# Altium schematic sheet SCREEN.SchDoc
size A3; SheetNumber: 10; SheetTotal: 17
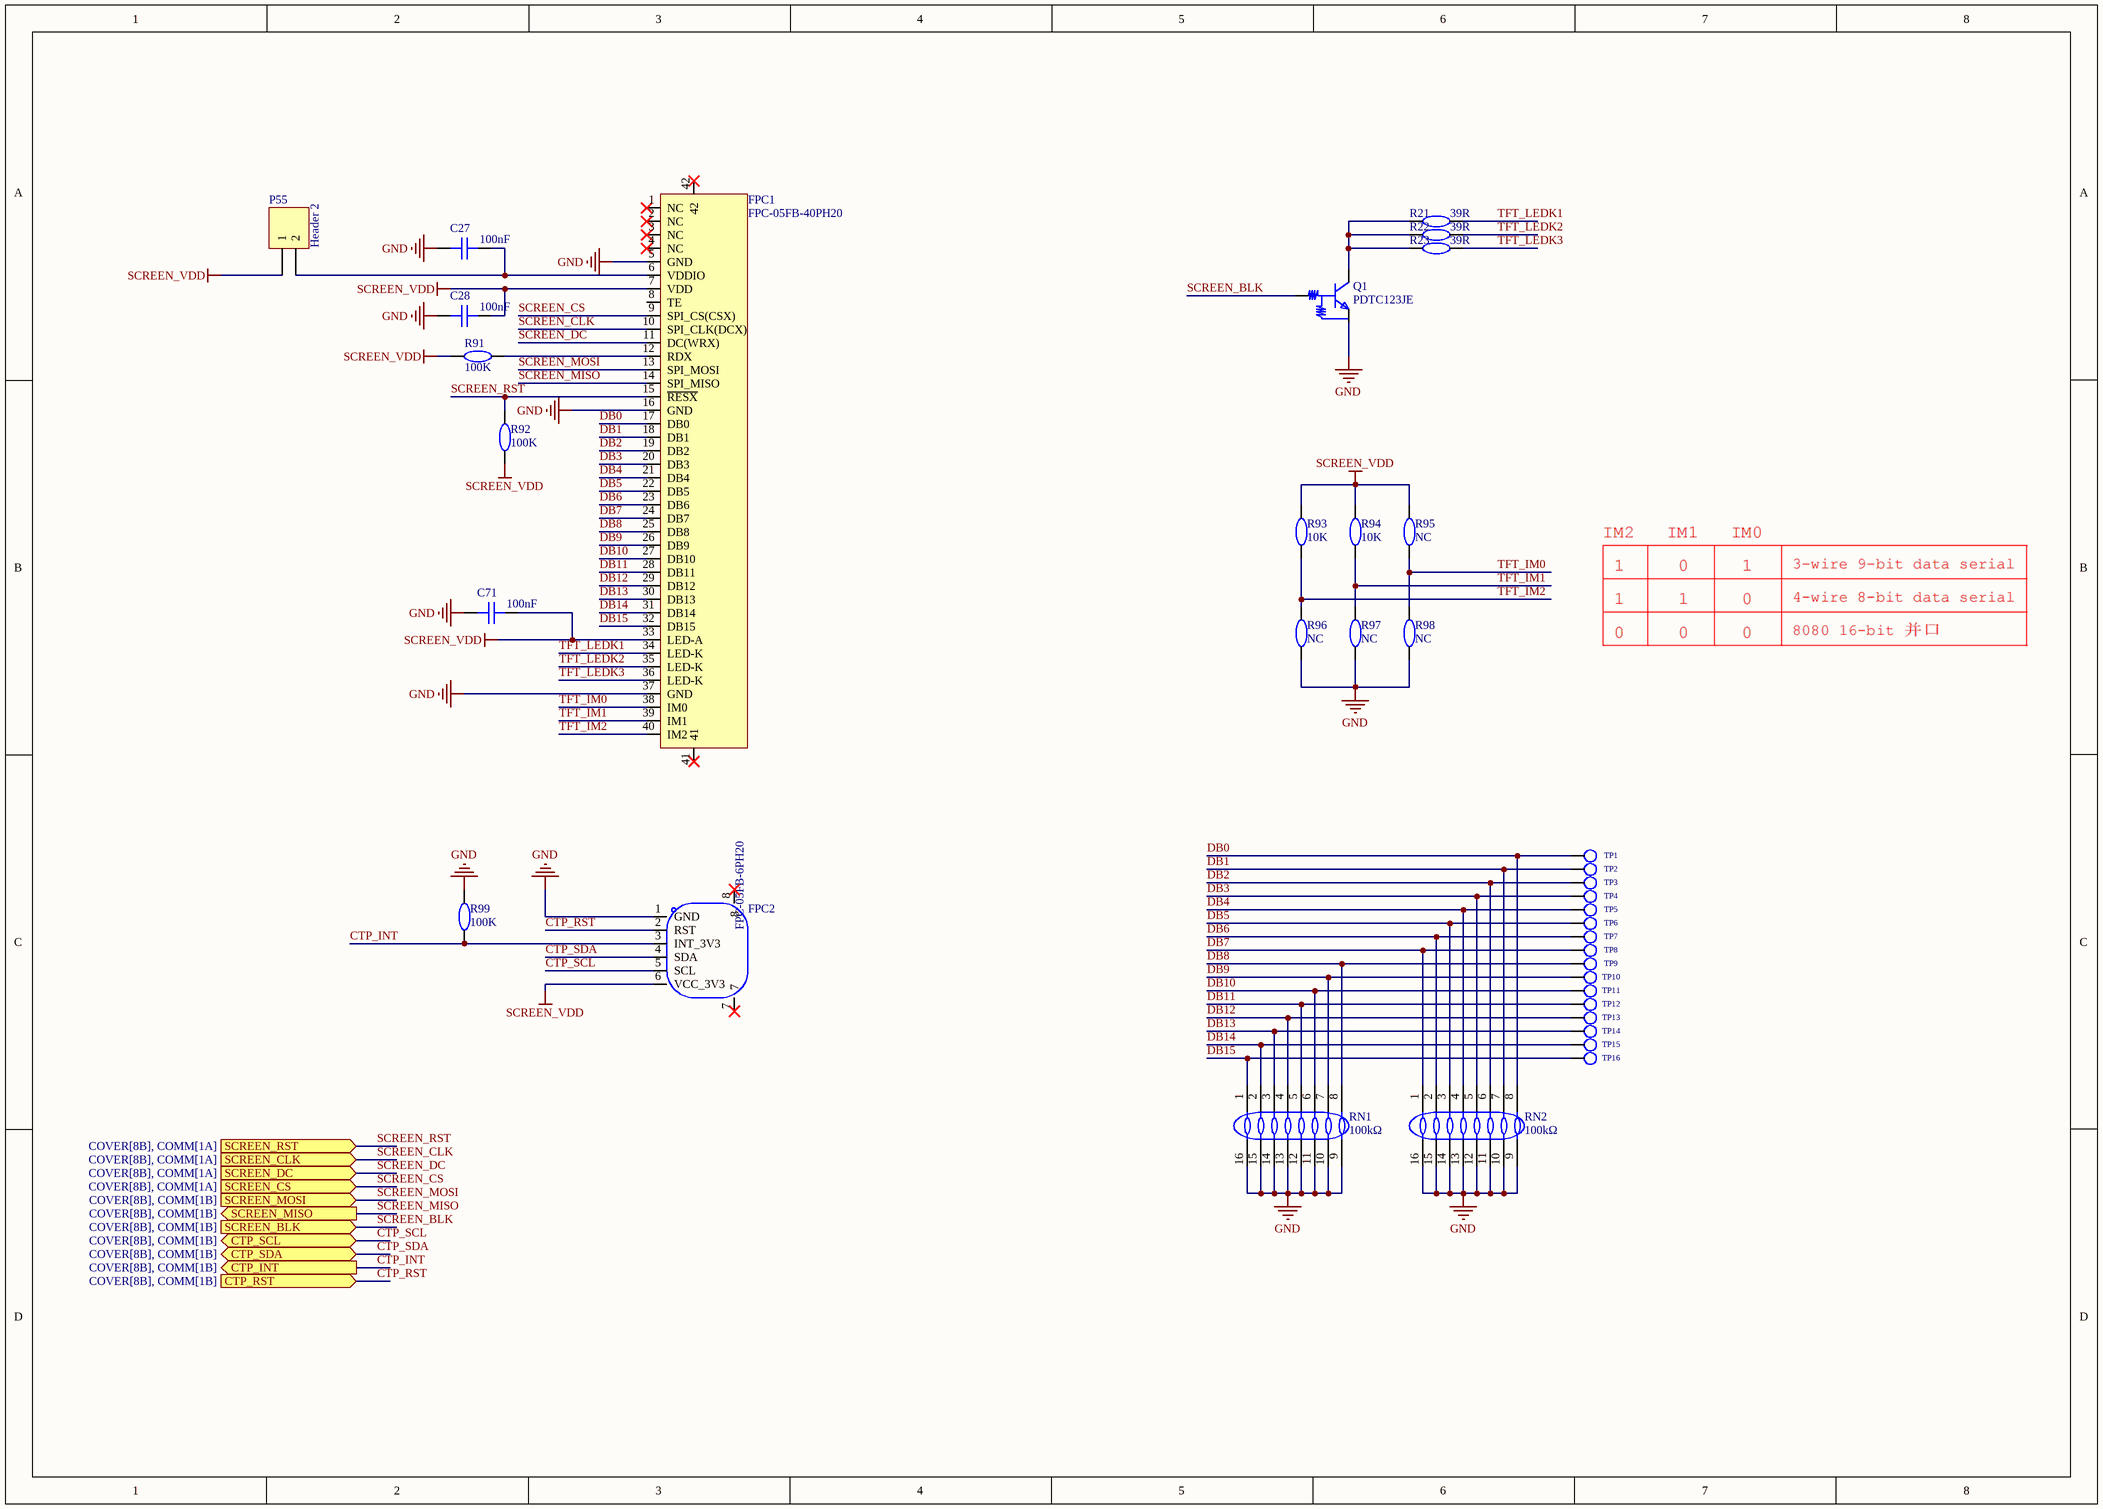
[diagram p0: SCREEN.SchDoc]

## Parts
C27  100nF  [C0402]
C28  100nF  [C0402]
C71  100nF  [C0402]
FPC1  FPC-05FB-40PH20  [FPC-SMD_40P-P0.50_XUNPU_FPC-05FB-40PH20]
FPC2  FPC-05FB-6PH20  [FPC-SMD_6P-P0.50_FPC-05FB-6PH20]
P55  Header 2  [HDR1X2]
Q1  PDTC123JE  [SOT-523_L1.6-W0.8-P1.00-LS1.6-BR]
R21  39R  [R0402]
R22  39R  [R0402]
R23  39R  [R0402]
R91  100K  [R0402]
R92  100K  [R0402]
R93  10K  [R0603]
R94  10K  [R0603]
R95  NC  [R0603]
R96  NC  [R0603]
R97  NC  [R0603]
R98  NC  [R0603]
R99  100K  [R0402]
RN1  100kΩ  [RES-ARRAY-SMD_16P-L3.8-W1.6-P0.50-BL]
RN2  100kΩ  [RES-ARRAY-SMD_16P-L3.8-W1.6-P0.50-BL]
TP1  T-SMD  [PAD_1.0_SMT]  (value not drawn)
TP2  T-SMD  [PAD_1.0_SMT]  (value not drawn)
TP3  T-SMD  [PAD_1.0_SMT]  (value not drawn)
TP4  T-SMD  [PAD_1.0_SMT]  (value not drawn)
TP5  T-SMD  [PAD_1.0_SMT]  (value not drawn)
TP6  T-SMD  [PAD_1.0_SMT]  (value not drawn)
TP7  T-SMD  [PAD_1.0_SMT]  (value not drawn)
TP8  T-SMD  [PAD_1.0_SMT]  (value not drawn)
TP9  T-SMD  [PAD_1.0_SMT]  (value not drawn)
TP10  T-SMD  [PAD_1.0_SMT]  (value not drawn)
TP11  T-SMD  [PAD_1.0_SMT]  (value not drawn)
TP12  T-SMD  [PAD_1.0_SMT]  (value not drawn)
TP13  T-SMD  [PAD_1.0_SMT]  (value not drawn)
TP14  T-SMD  [PAD_1.0_SMT]  (value not drawn)
TP15  T-SMD  [PAD_1.0_SMT]  (value not drawn)
TP16  T-SMD  [PAD_1.0_SMT]  (value not drawn)

## Ports
CTP_INT (out, see COVER[8B], COMM[1B]), CTP_RST (in, see COVER[8B], COMM[1B]), CTP_SCL (bidir, see COVER[8B], COMM[1B]), CTP_SDA (bidir, see COVER[8B], COMM[1B]), SCREEN_BLK (in, see COVER[8B], COMM[1B]), SCREEN_CLK (in, see COVER[8B], COMM[1A]), SCREEN_CS (in, see COVER[8B], COMM[1A]), SCREEN_DC (in, see COVER[8B], COMM[1A]), SCREEN_MISO (out, see COVER[8B], COMM[1B]), SCREEN_MOSI (in, see COVER[8B], COMM[1B]), SCREEN_RST (in, see COVER[8B], COMM[1A])

## Nets
GND: C27.1 C28.1 C71.1 FPC1.5(GND) FPC1.16(GND) FPC1.37(GND) FPC2.1(GND) Q1.2(GND) R96.1 R97.1 R98.1 R99.1 RN1.9 RN1.10 RN1.11 RN1.12 RN1.13 RN1.14 RN1.15 RN1.16 RN2.9 RN2.10 RN2.11 RN2.12 RN2.13 RN2.14 RN2.15 RN2.16
SCREEN_VDD: C28.2 C71.2 FPC1.7(VDD) FPC1.33(LED-A) FPC2.6(VCC_3V3) P55.1 R91.1 R92.1 R93.2 R94.2 R95.2
CTP_INT: FPC2.3(INT_3V3) R99.2 ; port CTP_INT
CTP_RST: FPC2.2(RST) ; port CTP_RST
CTP_SCL: FPC2.5(SCL) ; port CTP_SCL
CTP_SDA: FPC2.4(SDA) ; port CTP_SDA
DB0: FPC1.17(DB0) RN2.8 TP1.1
DB1: FPC1.18(DB1) RN2.7 TP2.1
DB2: FPC1.19(DB2) RN2.6 TP3.1
DB3: FPC1.20(DB3) RN2.5 TP4.1
DB4: FPC1.21(DB4) RN2.4 TP5.1
DB5: FPC1.22(DB5) RN2.3 TP6.1
DB6: FPC1.23(DB6) RN2.2 TP7.1
DB7: FPC1.24(DB7) RN2.1 TP8.1
DB8: FPC1.25(DB8) RN1.8 TP9.1
DB9: FPC1.26(DB9) RN1.7 TP10.1
DB10: FPC1.27(DB10) RN1.6 TP11.1
DB11: FPC1.28(DB11) RN1.5 TP12.1
DB12: FPC1.29(DB12) RN1.4 TP13.1
DB13: FPC1.30(DB13) RN1.3 TP14.1
DB14: FPC1.31(DB14) RN1.2 TP15.1
DB15: FPC1.32(DB15) RN1.1 TP16.1
SCREEN_BLK: Q1.1(IN) ; port SCREEN_BLK
SCREEN_CLK: FPC1.10(SPI_CLK(DCX)) ; port SCREEN_CLK
SCREEN_CS: FPC1.9(SPI_CS(CSX)) ; port SCREEN_CS
SCREEN_DC: FPC1.11(DC(WRX)) ; port SCREEN_DC
SCREEN_MISO: FPC1.14(SPI_MISO) ; port SCREEN_MISO
SCREEN_MOSI: FPC1.13(SPI_MOSI) ; port SCREEN_MOSI
SCREEN_RST: FPC1.15(~{RESX}) R92.2 ; port SCREEN_RST
TFT_IM0: FPC1.38(IM0) R95.1 R98.2
TFT_IM1: FPC1.39(IM1) R94.1 R97.2
TFT_IM2: FPC1.40(IM2) R93.1 R96.2
TFT_LEDK1: FPC1.34(LED-K) R21.2
TFT_LEDK2: FPC1.35(LED-K) R22.2
TFT_LEDK3: FPC1.36(LED-K) R23.2
NetC27_2: C27.2 FPC1.6(VDDIO) P55.2
NetFPC1_12: FPC1.12(RDX) R91.2
NetQ1_3: Q1.3(OUT) R21.1 R22.1 R23.1

Not connected (* = marked no-connect by the designer): FPC1 1(NC)* 2(NC)* 3(NC)* 4(NC)* 8(TE) 41* 42*; FPC2 7* 8*

## Library data of the parts
C27 C28 C71 = CAP_0402: Symbol: CapAcitance; Device: CAP_0603; Convert to PCB: yes; Add into BOM: yes; Supplier Footprint: 0603; Value: 100nF; Name: 100nF
FPC1 = 3.2TFT_FPC-05FB-40PH20: Manufacturer: XUNPU(讯普); Add into BOM: yes; Locking Feature: 翻盖式; Number of Contacts: 40P; Pitch: 0.5mm; FFC, FCB Thickness: 0.3mm; Symbol: FPC-05FB-40PH20; Device: FPC-05FB-40PH20; LCSC Part Name: 间距:0.5mm P数:40P 翻盖式 双侧触点/上下接; Supplier Part: C2856837; Manufacturer Part: FPC-05FB-40PH20; Supplier Footprint: SMD,P=0.5mm,卧贴; JLCPCB Part Class: 扩展库; Datasheet: https://atta.szlcsc.com/upload/public/pdf/source/20210922/C2856837_A0FF02895414764A7F2E525E58748FC4.pdf; Supplier: LCSC; Convert to PCB: yes; Contact Type: 双侧触点/上下接; Mounting Type: 卧贴; Height Above Board: 2mm; Operating Temperature Range: -25℃~+85℃; Name: FPC-05FB-40PH20
FPC2 = 3.2TFT_FPC-05FB-6PH20: Manufacturer: XUNPU(讯普); Add into BOM: yes; Locking Feature: 翻盖式; Number of Contacts: 6P; Pitch: 0.5mm; FFC, FCB Thickness: 0.3mm; Symbol: FPC-05FB-6PH20; Device: FPC-05FB-6PH20; LCSC Part Name: 间距:0.5mm P数:6P 翻盖式 双侧触点/上下接; Supplier Part: C2856827; Manufacturer Part: FPC-05FB-6PH20; Supplier Footprint: SMD,P=0.5mm,卧贴; JLCPCB Part Class: 扩展库; Datasheet: https://atta.szlcsc.com/upload/public/pdf/source/20210922/9700C5675183E5254BEFC967D607C435.pdf; Supplier: LCSC; Convert to PCB: yes; Contact Type: 双侧触点/上下接; Mounting Type: 卧贴; Height Above Board: 2mm; Operating Temperature Range: -25℃~+85℃; Name: FPC-05FB-6PH20
P55 = Header 2: Header, 2-Pin; LatestRevisionDate: 17-Jul-2002; LatestRevisionNote: Re-released for DXP Platform.; Publisher: Altium Limited
Q1 = PDTC123JE: Manufacturer: Prisemi(芯导); Add into BOM: yes; Symbol: PDTC123JE; Device: PDTC123JE; LCSC Part Name: PDTC123JE; Supplier Part: C5162511; Manufacturer Part: PDTC123JE; Supplier Footprint: SOT-523; JLCPCB Part Class: 扩展库; Datasheet: https://atta.szlcsc.com/upload/public/pdf/source/20220914/32F0D56C91C5C7C90374D12E52D8DD56.pdf; Supplier: LCSC; Convert to PCB: yes; Name: PDTC123JE
R21-R23 R91 R92 R99 = Res_0402: Symbol: 电阻; Device: Res_0603; Convert to PCB: yes; Add into BOM: yes; Supplier Footprint: 0603
  R21-R23: Value: 39R; Name: 39R
  R91 R92 R99: Value: 100K; Name: 100K
R93-R98 = Res_0603: Symbol: 电阻; Convert to PCB: yes; Device: Res_0603; Add into BOM: yes; Supplier Footprint: 0603
  R93 R94: Value: 10K; Name: 10K
  R95-R98: Value: NC; Name: NC
RN1 RN2 = EXB2HV104JV: Manufacturer: PANASONIC(松下); Add into BOM: yes; Number of Resistors: 8; Tolerance: ±5%; Power(Watts): 63mW; Temperature Coefficient: ±200ppm/℃; Symbol: EXB2HV104JV; Device: EXB2HV104JV; LCSC Part Name: 100kΩ ±5%; Supplier Part: C713455; Manufacturer Part: EXB2HV104JV; Supplier Footprint: SMD-16P,1.6x3.8mm; JLCPCB Part Class: 扩展库; Datasheet: https://atta.szlcsc.com/upload/public/pdf/source/20200731/C713455_CE8DFF94E3BC43FC82AF683E1C1CBAC4.pdf; Supplier: LCSC; Convert to PCB: yes; Value: 100kΩ; Number of Pins: 16; Name: 100kΩ
TP1-TP16 = T1.0-SMD: PCB DECAL: PAD1.0_SMT